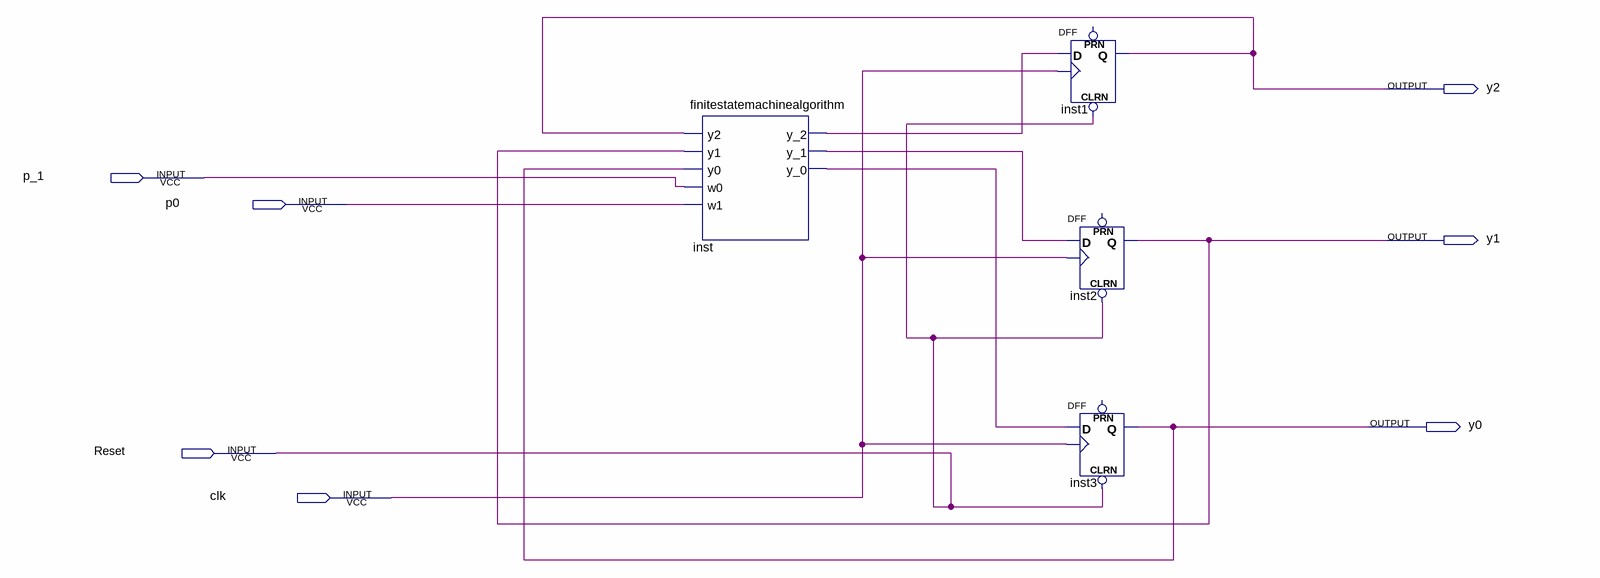
[diagram p0: schematic sheet]
// Quartus schematic finitestatemachine.bdf as structural Verilog: 4 symbols, 7 pins
module finitestatemachine (
  input  p_1,
  input  p0,
  input  Reset,
  input  clk,
  output y2,
  output y1,
  output y0
);

  wire inst_y_0, inst_y_1, inst_y_2;

  finitestatemachinealgorithm inst (
    .y2(y2), .y1(y1), .y0(y0), .w0(p_1), .w1(p0), .y_2(inst_y_2), .y_1(inst_y_1), .y_0(inst_y_0));
  DFF inst1 (.CLRN(Reset), .CLK(clk), .D(inst_y_2), .Q(y2));  // open: PRN
  DFF inst2 (.CLRN(Reset), .CLK(clk), .D(inst_y_1), .Q(y1));  // open: PRN
  DFF inst3 (.CLRN(Reset), .CLK(clk), .D(inst_y_0), .Q(y0));  // open: PRN
endmodule
